# EAGLE design MainBoard 1.7.0 (EAGLE 9.6.2)
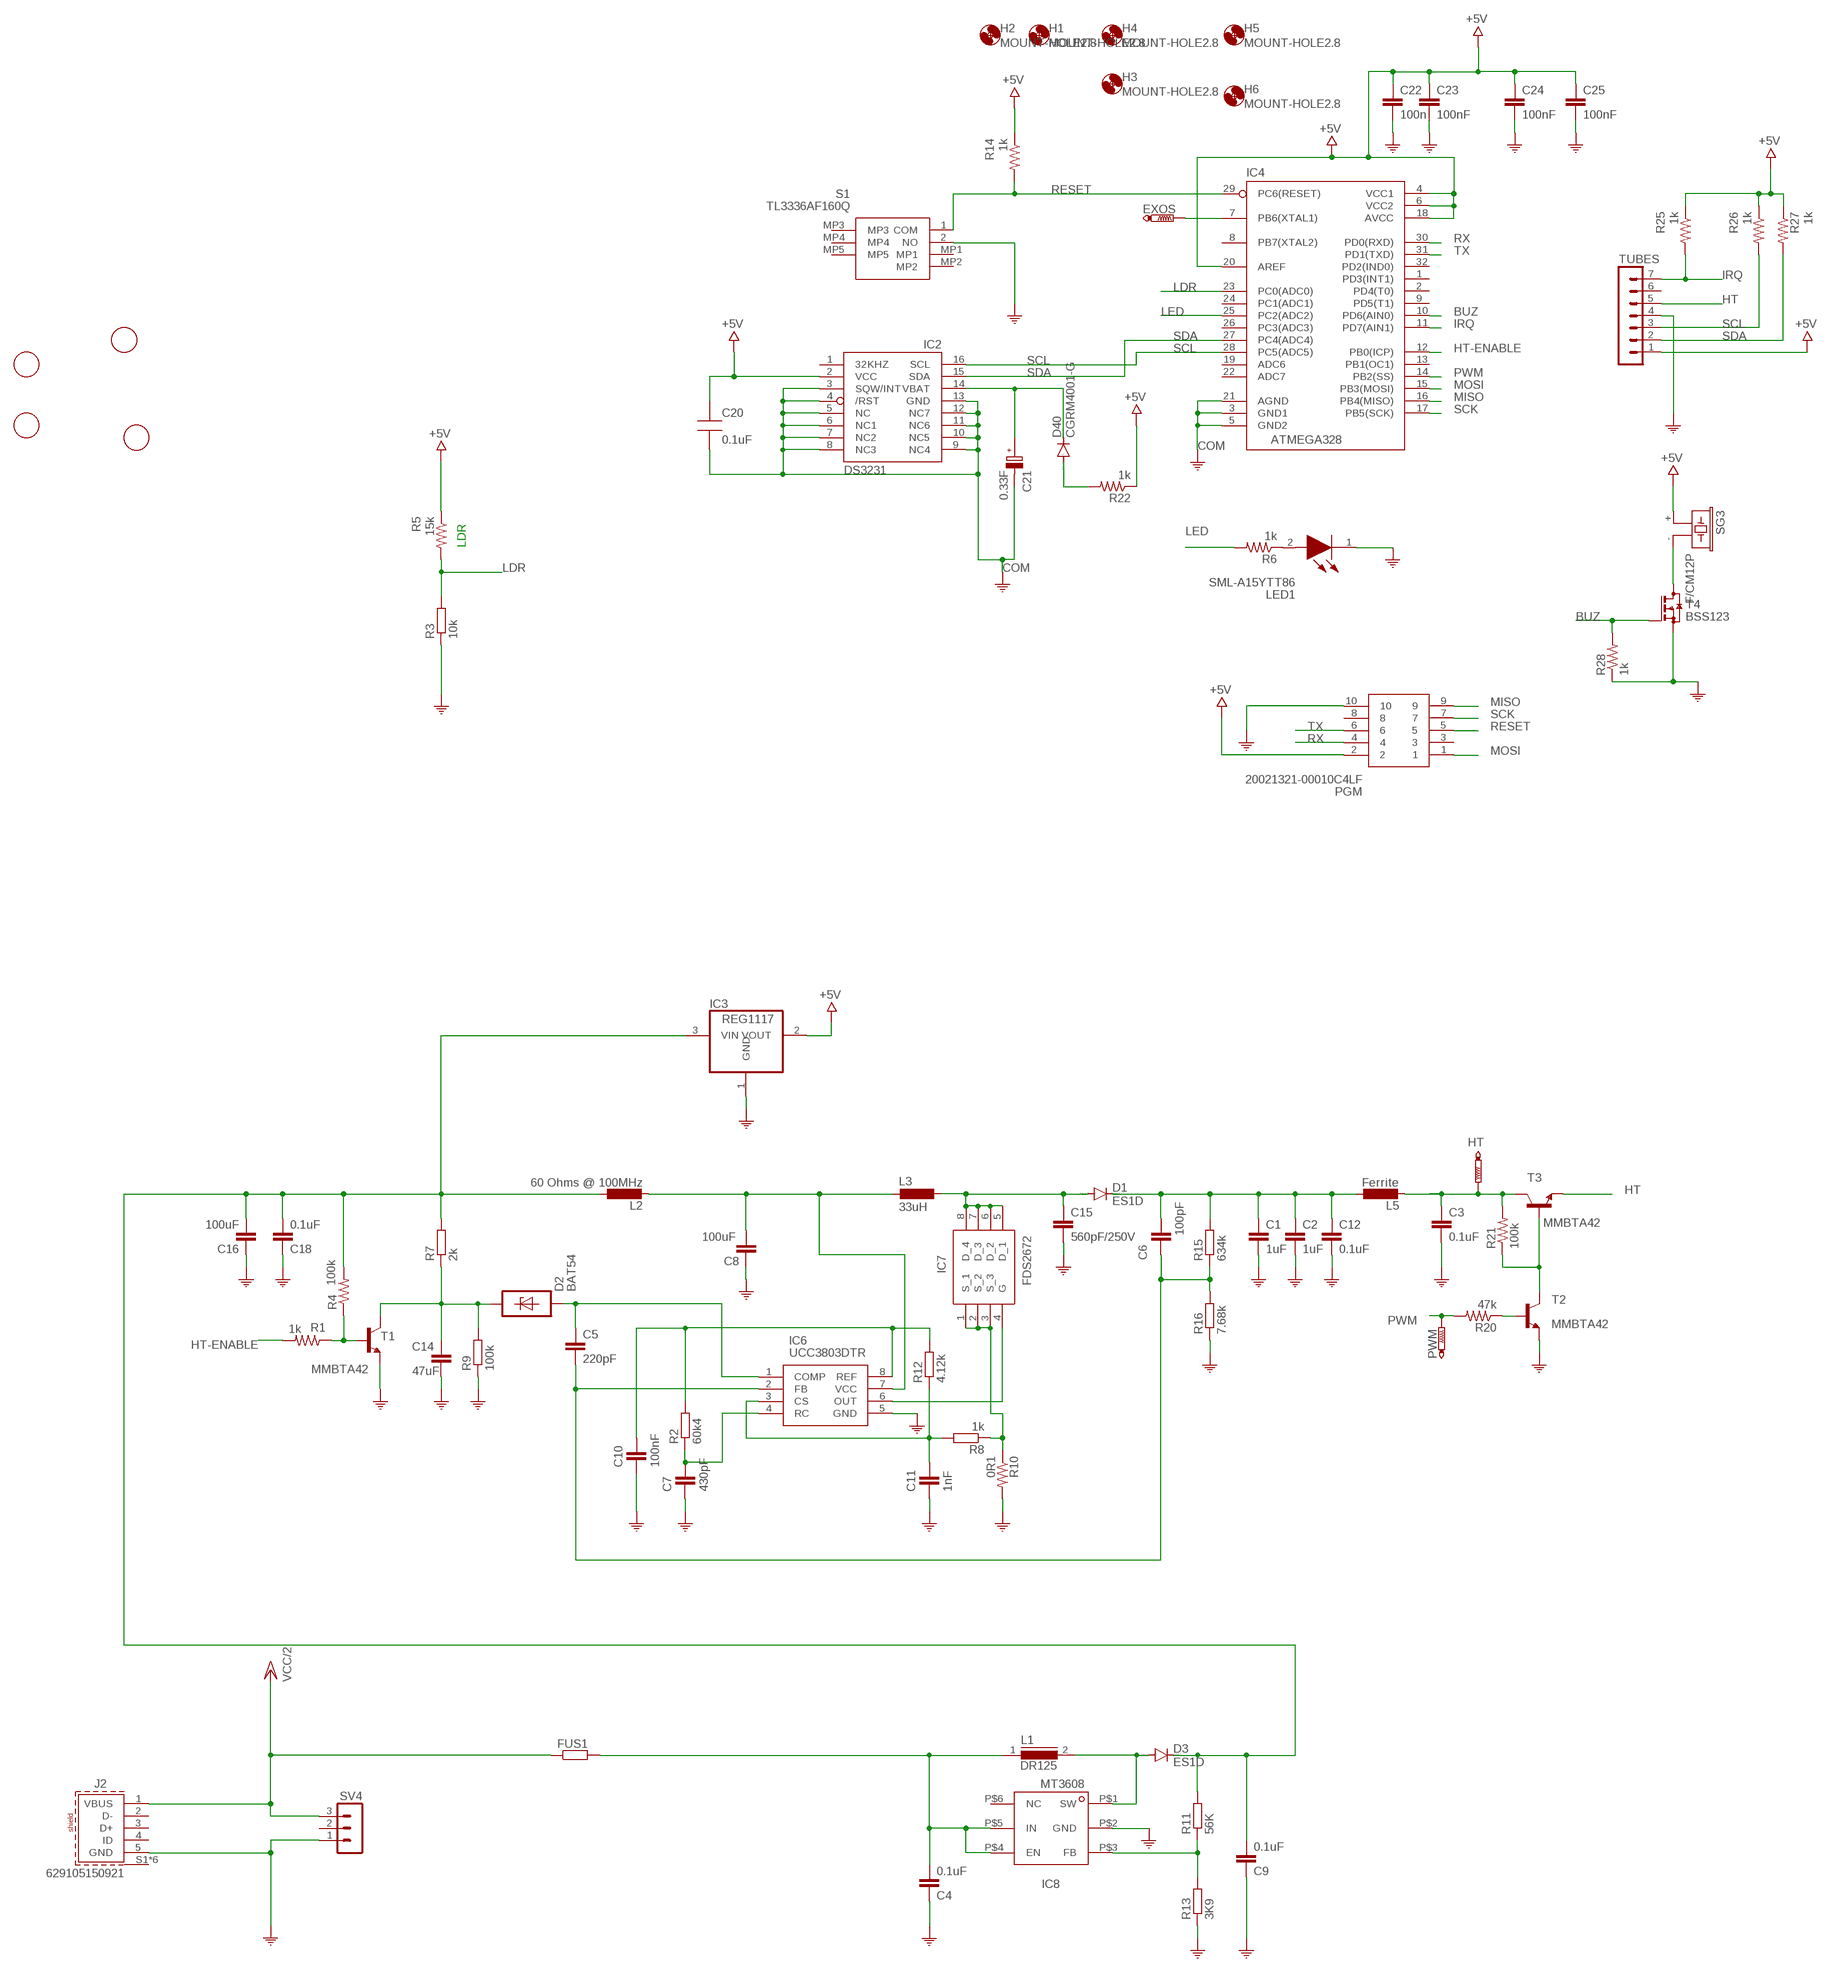
[diagram p0: schematic, sheet 1]

## Parts
C1  1uF  C-EUC1812K  [C1812K]
C2  1uF  C-EUC1812K  [C1812K]
C3  0.1uF  C-EUC1808  [C1808]
C4  0.1uF  C-EUC1206  [C1206]
C5  220pF  C-EUC0402  [C0402]
C6  100pF  C-EUC0805  [C0805]
C7  430pF  C-EUC0805  [C0805]
C8  100uF  C-EUC1210  [C1210]
C9  0.1uF  C-EUC1206K  [C1206K]
C10  100nF  C-EUC0805  [C0805]
C11  1nF  C-EUC0805  [C0805]
C12  0.1uF  C-EUC1808  [C1808]
C14  47uF  C-EUC1210  [C1210]
C15  560pF/250V  C-EUC0603  [C0603]
C16  100uF  C-EUC1210  [C1210]
C18  0.1uF  C-EUC0402  [C0402]
C20  0.1uF  CAP0805-NP  [CAP0805-NP]
C21  0.33F  AHG-35/100-RADIAL  [ELNA21.5X8.0]
C22  100n  C-EUC0805  [C0805]
C23  100nF  C-EUC0805  [C0805]
C24  100nF  C-EUC0805  [C0805]
C25  100nF  C-EUC0805  [C0805]
D1  ES1D  ES2D  [SMB]
D2  BAT54  SP4020-01FTG  [SOD323]
D3  ES1D  ES2D  [SMB]
D40  CGRM4001-G  [SOD-123_MINI-SMA]
EXOS  PTR1TP09R  [TP09R]
FUS1  R-EU_R6332  [R6332]
H1  MOUNT-HOLE2.8  [2,8]
H2  MOUNT-HOLE2.8  [2,8]
H3  MOUNT-HOLE2.8  [2,8]
H4  MOUNT-HOLE2.8  [2,8]
H5  MOUNT-HOLE2.8  [2,8]
H6  MOUNT-HOLE2.8  [2,8]
HT  PTR1TP09R  [TP09R]
IC2  DS3231/SO  [SO16W]
IC3  REG1117  [SOT223]
IC4  ATMEGA328  ATMEGA168-20AU  [QFP032]
IC6  UCC3803DTR  [SOIC127P600X175-8N]
IC7  FDS2672  [SOIC127P600X175-8N]
IC8  MT3608SOT23-6  [SOT23-6]
J2  629105150921  [629105150921]
L1  DR125  [DR125]
L2  60 Ohms @ 100MHz  L-EUL2012C  [L2012C]
L3  33uH  MSS7341  [MSS7341]
L5  Ferrite  L-EUL2012C  [L2012C]
LED1  SML-A15YTT86  [SMLA15YTT86]
PGM  20021321-00010C4LF  [2002132100010C4LF]
PWM  PTR1TP09R  [TP09R]
R1  1k  R-US_R0805  [R0805]
R2  60k4  R-EU_R0805  [R0805]
R3  10k  R-EU_0204/2V  [0204V]
R4  100k  R-US_R0805  [R0805]
R5  15k  R-US_M2012  [M2012]
R6  1k  R-US_M2012  [M2012]
R7  2k  R-EU_R0805  [R0805]
R8  1k  R-EU_R0805  [R0805]
R9  100k  R-EU_R0805  [R0805]
R10  0R1  R-US_R2010  [R2010]
R11  56K  R-EU_R0805  [R0805]
R12  4.12k  R-EU_R0805  [R0805]
R13  3K9  R-EU_R0805  [R0805]
R14  1k  R-US_M2012  [M2012]
R15  634k  R-EU_R0805  [R0805]
R16  7.68k  R-EU_R0805  [R0805]
R20  47k  R-US_R0805  [R0805]
R21  100k  R-US_R0805  [R0805]
R22  1k  R-US_M2012  [M2012]
R25  1k  R-US_M2012  [M2012]
R26  1k  R-US_M2012  [M2012]
R27  1k  R-US_M2012  [M2012]
R28  1k  R-US_M2012  [M2012]
S1  TL3336AF160Q  [TL3336AF160Q]
SG3  F/CM12P  [F/CM12P]
SV4  MA03-1  [MA03-1]
T1  MMBTA42  BC846  [SOT23]
T2  MMBTA42  BC846  [SOT23]
T3  MMBTA42  BC846  [SOT23]
T4  BSS123  [SOT23]
TUBES  MA07-1  [MA07-1]
U$4  FIDUCIAL  [FIDUCIAL_1MM]
U$5  FIDUCIAL  [FIDUCIAL_1MM]
U$20  FIDUCIAL  [FIDUCIAL_1MM]
U$36  FIDUCIAL  [FIDUCIAL_1MM]

## Nets
+5V [pwr]: C20.1 C22.1 C23.1 C24.1 C25.1 IC2.2(VCC) IC3.2(VOUT) IC4.4(VCC1) IC4.6(VCC2) IC4.18(AVCC) IC4.20(AREF) PGM.2 R5.1 R14.1 R22.1 R25.1 R26.1 R27.1 SG3.+ TUBES.1
BATT: C21.+ D40.C IC2.14(VBAT)
BUZ: IC4.10(PD6(AIN0)) R28.2 T4.1(G)
COM: C1.2 C2.2 C3.2 C4.2 C7.2 C8.1 C9.2 C10.2 C11.2 C12.2 C14.2 C15.2 C16.1 C18.2 C20.2 C21.- C22.2 C23.2 C24.2 C25.2 IC2.3(SQW/INT) IC2.4(/RST) IC2.5(NC) IC2.6(NC1) IC2.7(NC2) IC2.8(NC3) IC2.9(NC4) IC2.10(NC5) IC2.11(NC6) IC2.12(NC7) IC2.13(GND) IC3.1(GND) IC4.3(GND1) IC4.5(GND2) IC4.21(AGND) IC6.5(GND) IC8.P$2(GND) J2.5(GND) LED1.1(K) PGM.10 R3.1 R9.1 R10.2 R13.1 R16.1 R28.1 S1.2(NO) SV4.1 T1.2(E) T2.2(E) T4.2(S) TUBES.4
CS: C11.1 IC6.3(CS) R8.2 R12.1
FB: C5.2 C6.2 IC6.2(FB) R15.1 R16.2
HT: T3.2(E) TUBES.5
HT-ENABLE: IC4.12(PB0(ICP)) R1.2
IRQ: IC4.11(PD7(AIN1)) R25.2 TUBES.7
LDR: IC4.23(PC0(ADC0)) R3.2 R5.2
LED: IC4.25(PC2(ADC2)) R6.2
MISO: IC4.16(PB4(MISO)) PGM.9
MOSI: IC4.15(PB3(MOSI)) PGM.1
N$1: LED1.2(A) R6.1
N$2: C4.1 FUS1.2 IC8.P$4(EN) IC8.P$5(IN) L1.1
N$3: SG3.- T4.3(D)
N$5: EXOS.TP IC4.7(PB6(XTAL1))
N$6: C1.1 C2.1 C6.1 C12.1 D1.C L5.1 R15.2
N$7: R21.1 T2.3(C) T3.1(B)
N$8: R1.1 R4.1 T1.1(B)
N$9: C14.1 D2.C R7.1 R9.2 T1.3(C)
N$10: C5.1 D2.A IC6.1(COMP)
N$11: IC8.P$3(FB) R11.1 R13.2
N$12: IC7.1(S_1) IC7.2(S_2) IC7.3(S_3) R8.1 R10.1
N$13 [pwr]: D3.A IC8.P$1(SW) L1.2
N$14: C8.2 IC6.7(VCC) L2.2 L3.1
N$18: C15.1 D1.A IC7.5(D_1) IC7.6(D_2) IC7.7(D_3) IC7.8(D_4) L3.2
N$19: R20.1 T2.1(B)
N$23: D40.A R22.2
OUT: IC6.6(OUT) IC7.4(G)
POSTFUSE [pwr]: C9.1 C16.2 C18.1 D3.C IC3.3(VIN) L2.1 R4.2 R7.2 R11.2
PWM: IC4.14(PB2(SS)) PWM.TP R20.2
RAW_HT: C3.1 HT.TP L5.2 R21.2 T3.3(C)
RC: C7.1 IC6.4(RC) R2.1
REF: C10.1 IC6.8(REF) R2.2 R12.2
RESET: IC4.29(PC6(RESET)) PGM.5 R14.2 S1.1(COM)
RX: IC4.30(PD0(RXD)) PGM.4
SCK: IC4.17(PB5(SCK)) PGM.7
SCL: IC2.16(SCL) IC4.28(PC5(ADC5)) R26.2 TUBES.3
SDA: IC2.15(SDA) IC4.27(PC4(ADC4)) R27.2 TUBES.2
TX: IC4.31(PD1(TXD)) PGM.6
VCC/2: FUS1.1 J2.1(VBUS) SV4.3
Unconnected: IC2.1(32KHZ) IC4.1(PD3(INT1)) IC4.2(PD4(T0)) IC4.8(PB7(XTAL2)) IC4.9(PD5(T1)) IC4.13(PB1(OC1)) IC4.19(ADC6) IC4.22(ADC7) IC4.24(PC1(ADC1)) IC4.26(PC3(ADC3)) IC4.32(PD2(IND0)) IC8.P$6(NC) J2.2(D-) J2.3(D+) J2.4(ID) J2.S1(SHIELD) J2.S2(SHIELD) J2.S3(SHIELD) J2.S4(SHIELD) J2.S5(SHIELD) J2.S6(SHIELD) PGM.3 PGM.8 S1.MP1 S1.MP2 S1.MP3 S1.MP4 S1.MP5 SV4.2 TUBES.6

## Notes on the sheet
- LDR

## Library data of the parts
C1 C2 = rcl:C-EU: CAPACITOR, European symbol; MOUSER: 810-CGA8P3X7T2E105MA; PU: 1.07; SPICEPREFIX: C; TDK: C4532X7T2E105M250KE
C3 C12 = rcl:C-EU: CAPACITOR, European symbol; MOUSER: 581-1808PC104KAT1A; PU: 0.88; SPICEPREFIX: C
C4 C9 C18 = rcl:C-EU: CAPACITOR, European symbol; MOUSER: 963-LMF105B7104KVHF; PU: 0.676; SPICEPREFIX: C
C5 = rcl:C-EU: CAPACITOR, European symbol; MOUSER: 963-LMK042B7221KC-W; SPICEPREFIX: C
C6 = rcl:C-EU: CAPACITOR, European symbol; MOUSER: 81-GCM21A5C2E101JX1D; PU: 0.319; SPICEPREFIX: C
C7 = rcl:C-EU: CAPACITOR, European symbol; MOUSER: 581-08055A431JAT4A; PU: 0.23; SPICEPREFIX: C
C8 C16 = rcl:C-EU: CAPACITOR, European symbol; MOUSER: 963-EMK325ABJ107MM-P; SPICEPREFIX: C; TAIYO_YUDEN: EMK325ABJ107MM-P
C10 = rcl:C-EU: CAPACITOR, European symbol; MOUSER: 963-EMF212B7104KGHT; PU: 0.23; SPICEPREFIX: C
C11 = rcl:C-EU: CAPACITOR, European symbol; MOUSER: 710-885382207004; PU: 0.122; SPICEPREFIX: C
C14 = rcl:C-EU: CAPACITOR, European symbol; MOUSER: 963-EMK325BJ476MM-P; SPICEPREFIX: C
C15 = rcl:C-EU: CAPACITOR, European symbol; MOUSER: 80-C0603C561JAG; PU: 0.038; SPICEPREFIX: C
C20 = MySMD:CAP0805-NP
C21 = Elkos:AHG-35/100-RADIAL: AUDYN® - AHG Gepolt, radial High Grade AHG Gepolter Elekrolytkondensator für Audio-Netzteile, oder Verstärker im Home- und Car-Bereich. Technische Daten Anschlußdrähte: Kupfer, verzinnt AL: ? mm d2ø : ? mm Kapazitätsbereich: von 10 µF bis 2200 µF Nennspannungen: 25 V, 35 V, 50 V, 100 V C-Toleranz: 20 % ( bei 20° C ) Verlustfaktor: tan δ < 0,100 @ 1 kHz Temperaturbereich: - 40° C bis 85° C Verzerrung: sehr gering bei 10 kHz, 010 A - 120 dB oder niedriger gepolt AHG AUDYN® - AHG gepolt Bezeichnung C U DxH Rm Bestell.-Nr. U / Volt D x L/mm mm AHG/10.0/100V 10µF 100V 10x15 5,0 1341690 AHG/22.0/50V 22µF 50V 10x13 5,0 1341691 AHG/47.0/50V 47µF 50V 10x16 5,0 1341692 AHG/100.0/50V 100µF 50V 13x21 5,0 1341693 AHG/220.0/50V 220µF 50V 16x25 7,5 1341694 AHG/470.0/50V 470µF 50V 16x37 7,5 1341695 AHG/1000/35V 1000µF 35V 18x37 7,5 1341696 AHG/2200/35V 2200µF 35V 22x38 10,0 1341697 Alle Abmessungen in mm; MOUSER: 555-DBN-5R5D334T; PU: 2.46
C22-C25 = rcl:C-EU: CAPACITOR, European symbol; SPICEPREFIX: C
D1 D3 = diode:ES2D: DIODE super fast rectifier, 2 A; MOUSER: 512-ES1DF
D2 = sp4020_11:SP4020-01FTG: SP4020 Series 2.5pF, 30A Discrete TVS Diode Source: http://www.littelfuse.com/~/media/electronics/datasheets/tvs_diode_arrays/littelfuse_tvs_diode_array_sp4020_datasheet.pdf.pdf; MF: Littelfuse; MOUSER: 621-BAT54WS-F; MPN: SP4020-01FTG; OC_FARNELL: unknown; OC_NEWARK: 05X0400
D40 = diode:CGRM400*-G: Molded plasitc,JEDEC SOD-123/Mini SMA Source: Comchip CGRM4001-G.pdf; MOUSER: 863-NSR0320MW2T1G; PU: 0.22
EXOS HT PWM = testpad:PTR1: TEST PIN
FUS1 = rcl:R-EU_: RESISTOR, European symbol; MOUSER: 530-0ZCG0150AF2C; PU: 0.2; SPICEPREFIX: R
H1-H6 = holes:MOUNT-HOLE: MOUNTING HOLE with drill center marker
IC2 = DS3231:DS3231; AVAILABILITY: Unavailable; MF: Maxim Integrated; MOUSER: 700-DS3231SN#; MP: DS3231; PACKAGE: SOIC-16 Maxim Integrated; PRICE: None; PU: 9.50
IC3 = burr-brown:REG1117: 800mA and 1A Low Dropout (LDO) Positive Regulator 1.8V, 2.5V, 2.85V, 3.3V, 5V, and Adj; MPN: REG1117; OC_FARNELL: 1097566; OC_NEWARK: 14P6981
IC4 = MySMD:ATMEGA168-20AU; PU: 1.40
IC6 = UCC3803DTR:UCC3803DTR: Switching Controllers Low-Power BiCMOS Current-Mode PWM Source: Datasheet <http://www.ti.com/lit/ds/symlink/ucc3803.pdf>; DESCRIPTION: Switching Controllers Low-Power BiCMOS Current-Mode PWM; HEIGHT: 1.75mm; MANUFACTURER_NAME: Texas Instruments; MANUFACTURER_PART_NUMBER: UCC3803DTR; MOUSER: 595-UCC3803D; MOUSER_PART_NUMBER: 595-UCC3803DTR; MOUSER_PRICE-STOCK: https://www.mouser.com/Search/Refine.aspx?Keyword=595-UCC3803DTR; PU: 3.05
IC7 = FDS2672:FDS2672: FDS2672, N-channel MOSFET Transistor 3.9 A 200 V, 8-Pin SOIC Source: Datasheet <http://docs-emea.rs-online.com/webdocs/0d23/0900766b80d23481.pdf>; DESCRIPTION: FDS2672, N-channel MOSFET Transistor 3.9 A 200 V, 8-Pin SOIC; HEIGHT: 1.75mm; MANUFACTURER_NAME: Fairchild Semiconductor; MANUFACTURER_PART_NUMBER: FDS2672; MOUSER: 512-FDS2672; MOUSER_PART_NUMBER: 512-FDS2672; MOUSER_PRICE-STOCK: https://www.mouser.com/Search/Refine.aspx?Keyword=512-FDS2672; PU: 1.54; RS_PART_NUMBER: 6710481P; RS_PRICE-STOCK: http://uk.rs-online.com/web/p/products/6710481P
IC8 = MT3608:MT3608: MT3608 High Efficiency 1.2MHz 2A Step Up Converter BY: Rangana Tennakoon
J2 = Wurth_Connectors_WR-USB:629105150921: WR-COM Micro USB 2.0 Type AB Horizontal Kind Properties Durability:10 000 Mating cycles Connector Type:Micro USB Gender:Receptacle Type:Horizontal General Information Operating Temperature:-40up to +85 °C Electrical Properties Working Voltage:30V (AC) Withstanding Voltage:100V (AC) Contact Resistance:30 mΩ Material Properties Insulator Material:LCP Insulator Flammability Rating:UL94 V-0 Color:Black Contact Material:Copper Alloy Contact Plating: Gold Contact Type:Stamped Shielding Material:Stainless Steel Shielding Plating:Matte Tin <https://www.we-online.com/catalog/media/o33046v209%20Family_WR-COM_Micro_USB_629105150921.jpg> Details see: https://www.we-online.com/catalog/en/COM_MICRO_2_0_TYPE_AB_HORIZONTAL/ Updated by Ella Wu 2021-03-09 2021 (C) Würth Elektronik; APPLICATION: Micro USB 2.0; DATASHEET-URL: https://www.we-online.com/catalog/datasheet/629105150921.pdf; GERDER: Receptacle; INTERFACE-TYPE: Type AB; IR1: 1.8A; MOUNT: SMT; MOUSER: 710-629105150921; PACKAGING: Tape and Reel; PART-NUMBER: 629105150921; PINS: 5; PU: 1.90; TYPE: Horizontal; WORKING-VOLTAGE: 30V(AC)
L1 = inductors:DR125: High Power Density, High Efficiency, Shielded Inductors Source: coiltronics_dr_series.pdf; SPICEPREFIX: L
L2 L5 = rcl:L-EU: INDUCTOR, European symbol; MOUSER: 963-BKP2125HS600-T; SPICEPREFIX: L
L3 = STEAM-inductor-coilcraft:MSS7341: Shielded Power Inductors Package 6.6 × 6.6 mm x 4.1 mm high Source: http://www.farnell.com/datasheets/1681958.pdf; MOUSER: 710-784770330; PU: 2.55
LED1 = SamacSys_Parts:SML-A15YTT86: Yellow 590nm LED Indication - Discrete 2.1V 2-SMD, No Lead Source: Datasheet <https://fscdn.rohm.com/en/products/databook/datasheet/opto/led/chip_mono/sml-a15x-e.pdf>; DESCRIPTION: Yellow 590nm LED Indication - Discrete 2.1V 2-SMD, No Lead; HEIGHT: 0.65mm; MANUFACTURER_NAME: ROHM Semiconductor; MANUFACTURER_PART_NUMBER: SML-A15YTT86; MOUSER: 755-SML-A15YTT86; PU: 0.25
PGM = SamacSys_Parts:20021321-00010C4LF: Headers & Wire Housings 1.27x1.27mm BTB, Hdr Recept, SMT, 10 Pos Source: Datasheet <https://componentsearchengine.com/Datasheets/1/20021321-00010C4LF.pdf>; DESCRIPTION: Headers & Wire Housings 1.27x1.27mm BTB, Hdr Recept, SMT, 10 Pos; HEIGHT: 4.75mm; MANUFACTURER_NAME: Amphenol; MANUFACTURER_PART_NUMBER: 20021321-00010C4LF; MOUSER_PART_NUMBER: 649-202132100010C4LF; MOUSER_PRICE-STOCK: https://www.mouser.com/Search/Refine.aspx?Keyword=649-202132100010C4LF
R1 R4-R6 R14 R20-R22 R25-R28 = adafruit:R-US_: RESISTOR, American symbol
R2 = rcl:R-EU_: RESISTOR, European symbol; MOUSER: 603-RT0805FRE0760K4L; PU: 0.11; SPICEPREFIX: R
R3 R8 R9 = rcl:R-EU_: RESISTOR, European symbol; SPICEPREFIX: R
R7 = rcl:R-EU_: RESISTOR, European symbol; MOUSER: 754-RR1220P-202D; SPICEPREFIX: R; SUSUMU: RR1220P-202-D
R10 = adafruit:R-US_: RESISTOR, American symbol; MOUSER: 603-PE2010FKE070R1L; PU: 0.7
R11 R13 R15 = rcl:R-EU_: RESISTOR, European symbol; MOUSER: 71-CRCW0603-634K-E3; SPICEPREFIX: R; VISHAY: CRCW0603634KFKEA
R12 = rcl:R-EU_: RESISTOR, European symbol; KOASPEER: RN732ATTD4121F100; MOUSER: 660-RN732ATD4121F100; SPICEPREFIX: R
R16 = rcl:R-EU_: RESISTOR, European symbol; MOUSER: 71-CRCW0805-7.68K-E3; PU: 0.09; SPICEPREFIX: R; VISHAY: CRCW08057K68FKEA
S1 = SamacSys_Parts:TL3336AF160Q: Tactile Switches Tactile Switch SPST OFF-(ON) 50mA, 12VDC, Right Angle SMT Source: Datasheet <http://spec_sheets.e-switch.com/specs/P158001.pdf>; DESCRIPTION: Tactile Switches Tactile Switch SPST OFF-(ON) 50mA, 12VDC, Right Angle SMT; HEIGHT: 7.35mm; MANUFACTURER_NAME: E-Switch; MANUFACTURER_PART_NUMBER: TL3336AF160Q; MOUSER_PART_NUMBER: 612-TL3336AF160Q; MOUSER_PRICE-STOCK: https://www.mouser.co.uk/ProductDetail/E-Switch/TL3336AF160Q?qs=iLbezkQI%252Bshf0NMs3%252BGhxA%3D%3D
SG3 = buzzer:F/CM12P: BUZZER Source: Buerklin; OC_FARNELL: unknown; OC_NEWARK: unknown
SV4 = con-lstb:MA03-1: PIN HEADER; OC_FARNELL: unknown; OC_NEWARK: unknown
T1-T3 = transistor:BC846: NPN TRANSISTOR
T4 = transistor-small-signal:BSS123: N-CHANNEL MOS FET; MOUSER: 726-BSS123NH6433; PU: 0.37
TUBES = con-lstb:MA07-1: PIN HEADER; OC_FARNELL: unknown; OC_NEWARK: unknown
U$4 U$5 U$20 U$36 = adafruit:FIDUCIAL: For use by pick and place machines to calibrate the vision/machine, 1mm By microbuilder.eu

## Module TUBEIN16
Ports: 

### Library data of the parts

## Net classes
0 default: width 0.254 mm, clearance 0.254 mm
1 pwr: width 0.254 mm, clearance 0.356 mm

## Board
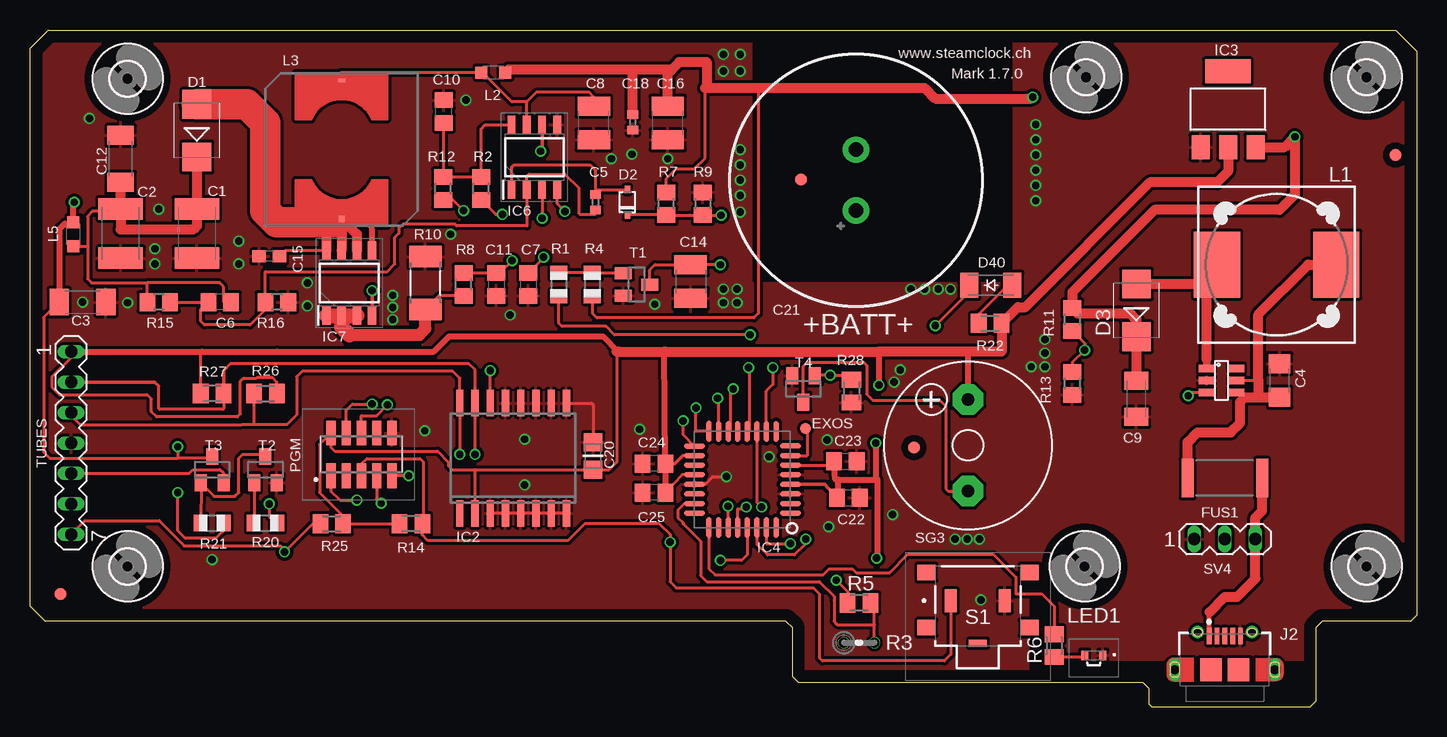
[diagram p1: board, top side]
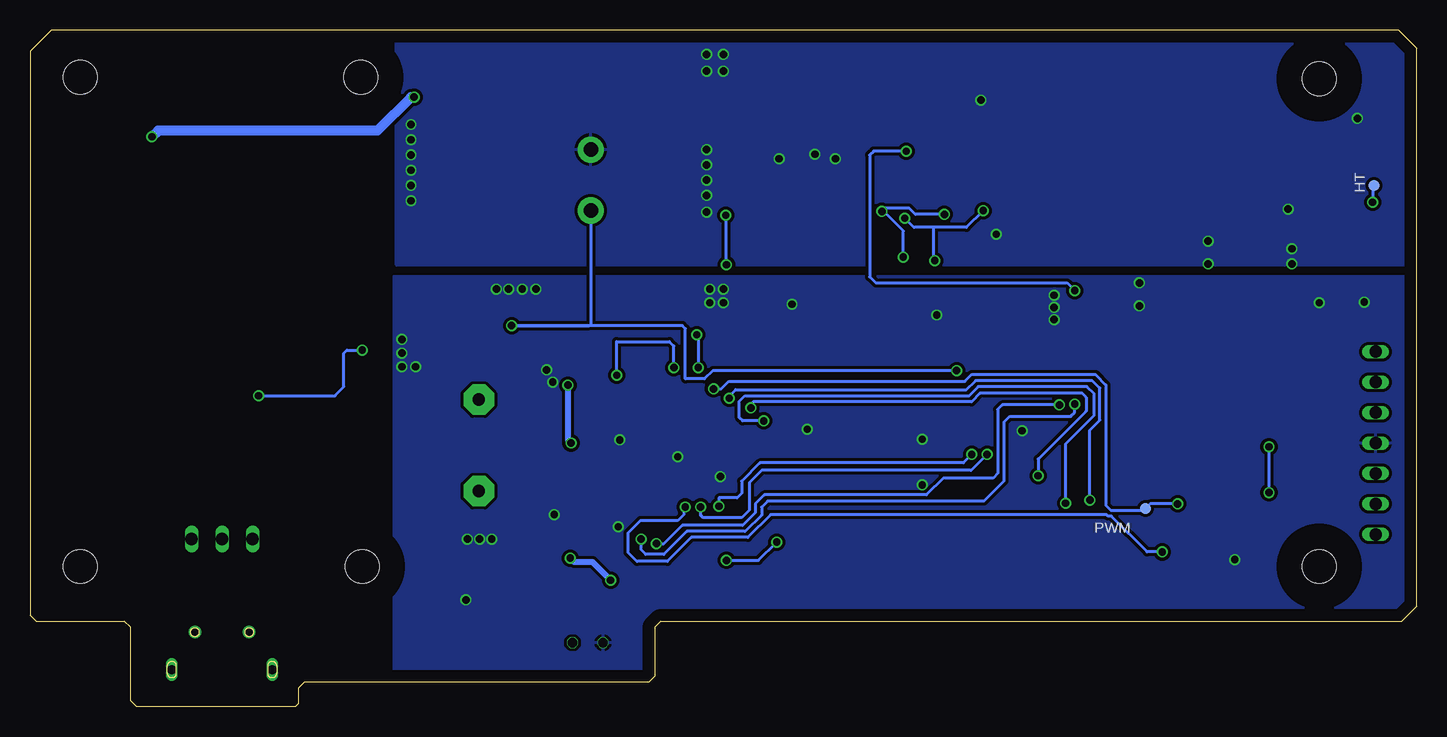
[diagram p2: board, bottom side, seen from below]

Size 115.57 x 56.39 mm. Coordinates in mm from the lower left corner, seen from the top.
Outline: 1.52,56.39 113.79,56.39 115.57,54.61 115.57,7.62 115.06,7.11 107.7,7.11 107.19,6.6 107.19,0.51 106.68,0 93.47,0 93.22,0.25 93.22,1.52 92.71,2.03 64.01,2.03 63.5,2.54 63.5,6.6 62.99,7.11 1.27,7.11 0,8.38 0,54.86 1.52,56.39
Copper layers (1*16): Top 0.035mm / dielectric 1.5mm / Bottom 0.035mm
Design rules "default *": minimum track width 10mil, minimum drill 24mil, track to track 4mil, track to pad 1mil, pad to pad 1mil, via to via 8mil, smd to smd 8mil, copper to edge 40mil, drill to drill 8mil, minimum pad ring 1mil, minimum via ring 3mil, stop-mask expansion 4mil, vias tented up to drill 0mil, thermal gap 10mil

### Footprints (pad centres in the part's own frame; a part is rotated, then mirrored left to right if it is on the bottom)
C1812K = smd 1.8 x 3.7: 1 -2.05,0; 2 2.05,0
C1808 = smd 1.6 x 2.2: 1 -1.95,0; 2 1.95,0
C1206 = smd 1.6 x 1.8: 1 -1.4,0; 2 1.4,0
C0402 = smd 0.7 x 0.9: 1 -0.65,0; 2 0.65,0
C0805 = smd 1.3 x 1.5: 1 -0.95,0; 2 0.95,0
C1210 = smd 1.6 x 2.7: 1 -1.4,0; 2 1.4,0
C1206K = smd 1.5 x 2: 1 -1.5,0; 2 1.5,0
C0603 = smd 1.1 x 1: 1 -0.85,0; 2 0.85,0
CAP0805-NP = smd 1.524 x 1.524: 1 0,0; 2 2.286,0
ELNA21.5X8.0 = drill 1.2 pad 2.184: + -2.54,0; - 2.54,0
SMB = smd 2.4 x 2.4: A 2.2,0; C -2.2,0
SOD323 = smd 0.6 x 0.45: A 1.06,0; C -1.06,0
SOD-123_MINI-SMA = smd 1.5 x 2.1: A 1.8,0; C -1.8,0
TP09R = smd 0.9 x 0.9: TP 0,0
R6332 = smd 1 x 3.2: 1 -3.1,0; 2 3.1,0
2,8 = hole 2.8: 0,0
SO16W = smd 0.6 x 2.2: 1 -4.445,-4.6; 2 -3.175,-4.6; 3 -1.905,-4.6; 4 -0.635,-4.6; 5 0.635,-4.6; 6 1.905,-4.6; 7 3.175,-4.6; 8 4.445,-4.6; 9 4.445,4.6; 10 3.175,4.6; 11 1.905,4.6; 12 0.635,4.6; 13 -0.635,4.6; 14 -1.905,4.6; 15 -3.175,4.6; 16 -4.445,4.6
SOT223 = smd 1.499 x 2.007: 1 -2.261,-3.15; 2 0.025,-3.15; 3 2.311,-3.15 | smd 3.81 x 2.007: 4 0,3.15
QFP032 = smd 0.432 x 1.778: 1 0,0; 2 0.8,0; 3 1.599,0; 4 2.399,0; 5 3.199,0; 6 3.998,0; 7 4.798,0; 8 5.598,0; 17 5.588,8.001; 18 4.798,7.997; 19 3.998,7.997; 20 3.199,7.997; 21 2.399,7.997; 22 1.599,7.997; 23 0.799,7.997; 24 0,7.997 | smd 1.778 x 0.432: 9 6.807,1.194; 10 6.807,2.007; 11 6.807,2.794; 12 6.807,3.607; 13 6.807,4.394; 14 6.807,5.182; 15 6.807,5.994; 16 6.816,6.803; 25 -1.194,6.807; 26 -1.194,5.994; 27 -1.194,5.182; 28 -1.194,4.394; 29 -1.194,3.607; 30 -1.194,2.794; 31 -1.194,2.007; 32 -1.194,1.194
SOIC127P600X175-8N = smd 1.525 x 0.65: 1 -2.712,1.905; 2 -2.712,0.635; 3 -2.712,-0.635; 4 -2.712,-1.905; 5 2.712,-1.905; 6 2.712,-0.635; 7 2.712,0.635; 8 2.712,1.905
SOIC127P600X175-8N' = smd 1.525 x 0.7: 1 -2.712,1.905; 2 -2.712,0.635; 3 -2.712,-0.635; 4 -2.712,-1.905; 5 2.712,-1.905; 6 2.712,-0.635; 7 2.712,0.635; 8 2.712,1.905
SOT23-6 = smd 1.27 x 0.635: P$1 0,0; P$2 0,-1; P$3 0,-2; P$4 2.5,-2; P$5 2.5,-1; P$6 2.5,0
629105150921 = smd 0.4 x 1.35: 1 -1.3,2.335; 2 -0.65,2.335; 3 0,2.335; 4 0.65,2.335; 5 1.3,2.335 | drill 0.65 pad 1.05: S1 -2.26,2.65; S2 2.26,2.65 | drill 0.75 pad 0.95 long: S3 -4.175,-0.47; S6 4.175,-0.47 | smd 1.8 x 1.9: S4 -1.15,-0.47; S5 1.15,-0.47
DR125 = smd 3.85 x 5.5: 1 -4.975,0; 2 4.975,0
L2012C = smd 1 x 1: 1 -1,0; 2 1,0
MSS7341 = smd 0.61 x 0.305: 1 0,5.765 | smd 0.5 x 0.5: 2 0,-5.765
SMLA15YTT86 = smd 0.6 x 0.8: 1 -0.75,-0.205; 2 0.75,-0.205
2002132100010C4LF = smd 0.76 x 2.05: 1 2.54,1.775; 2 2.54,-1.775; 3 1.27,1.775; 4 1.27,-1.775; 5 0,1.775; 6 0,-1.775; 7 -1.27,1.775; 8 -1.27,-1.775; 9 -2.54,1.775; 10 -2.54,-1.775
R0805 = smd 1.1 x 1.4: 1 -1,0; 2 1,0
R0805' = smd 1.3 x 1.5: 1 -0.95,0; 2 0.95,0
0204V = drill 0.813 octagon: 1 -1.27,0; 2 1.27,0
M2012 = smd 1.3 x 1.6: 1 -0.95,0; 2 0.95,0
R2010 = smd 1.8 x 2.7: 1 -2.2,0; 2 2.2,0
TL3336AF160Q = smd 1 x 1.9: 1 2.25,-0.45; 2 -2.25,-0.45 | smd 1.5 x 1.3: MP1 4.3,1.8; MP2 4.3,-2.8; MP3 -4.3,-2.8; MP4 -4.3,1.8 | smd 1.5 x 0.6: MP5 0,3.1
F/CM12P = drill 1.016 pad 2.54 octagon: + 3.81,0; - -3.81,0
MA03-1 = drill 1.016 long: 1 -2.54,0; 2 0,0; 3 2.54,0
SOT23 = smd 1 x 1.4: 1 -0.95,-1.1; 2 0.95,-1.1; 3 0,1.1
MA07-1 = drill 1.016 long: 1 -7.62,0; 2 -5.08,0; 3 -2.54,0; 4 0,0; 5 2.54,0; 6 5.08,0; 7 7.62,0
FIDUCIAL_1MM = smd 1 x 1: 1 0,0

### Placement (x,y rotation side)
C1  13.91,39.43 270 top
C2  7.56,39.43 270 top
C3  4.38,33.72 0 top
C4  104.14,27.18 90 top
C5  47.12,42.04 270 top
C6  15.81,33.72 180 top
C7  41.53,35.18 270 top
C8  46.99,48.64 90 top
C9  92.2,25.65 270 top
C10  34.48,49.59 90 top
C11  38.86,35.18 270 top
C12  7.56,45.66 90 top
C14  55.05,35.43 270 top
C15  19.94,37.53 180 top
C16  53.15,48.64 90 top
C18  50.23,48.7 270 top
C20  46.93,19.75 90 top
C21  68.83,43.88 90 top
C22  68.2,17.4 0 top
C23  67.95,20.45 0 top
C24  52.01,20.26 180 top
C25  52.01,17.84 180 top
D1  13.91,48.01 90 top
D2  49.78,42.04 90 top
D3  92.2,33.02 90 top
D40  80.07,35.12 0 top
EXOS  64.64,23.18 0 top
FUS1  99.57,19.05 180 top
H1  111.38,52.45 0 top
H2  111.38,11.68 0 top
H3  8.13,52.32 0 top
H4  8.13,11.68 0 top
H5  87.88,11.68 0 top
H6  88.01,52.45 0 top
HT  3.56,43.43 0 bottom
IC2  40.26,20.7 0 top
IC3  99.82,49.78 0 top
IC4  63.37,16.13 90 top
IC6  42.04,45.78 90 top
IC7  FDS2672  [SOIC127P600X175-8N']  26.61,35.31 90 top
IC8  98.04,28.19 0 top
J2  99.57,3.56 0 top
L1  103.89,36.83 180 top
L2  38.61,52.83 180 top
L3  25.97,46.42 0 top
L5  3.62,39.37 90 top
LED1  88.65,4.06 180 top
PGM  27.62,21.02 180 top
PWM  22.61,16.51 0 bottom
R1  44.07,35.18 270 top
R2  60k4  [R0805']  37.59,43.18 90 top
R3  69.09,5.33 0 top
R4  46.86,35.18 270 top
R5  69.09,8.64 0 top
R6  85.34,5.08 90 top
R7  2k  [R0805']  53.02,41.91 90 top
R8  1k  [R0805']  36.13,35.18 90 top
R9  100k  [R0805']  56.07,41.91 270 top
R10  32.96,35.31 90 top
R11  56K  [R0805']  86.87,32.26 90 top
R12  4.12k  [R0805']  34.42,43.18 90 top
R13  3K9  [R0805']  86.87,26.92 90 top
R14  31.75,15.24 0 top
R15  634k  [R0805']  10.73,33.72 180 top
R16  7.68k  [R0805']  20.57,33.72 180 top
R20  19.62,15.3 0 top
R21  15.18,15.3 0 top
R22  80.01,31.94 180 top
R25  25.15,15.24 180 top
R26  19.62,26.1 180 top
R27  15.18,26.1 0 top
R28  68.45,26.29 90 top
S1  78.99,8.38 180 top
SG3  78.17,21.78 90 top
SV4  99.57,13.97 0 top
T1  50.55,35.18 270 top
T2  19.62,19.75 0 top
T3  15.18,19.75 0 top
T4  64.45,26.48 180 top
TUBES  3.43,21.97 270 top
U$4  2.54,9.4 0 top
U$5  73.66,21.59 0 top
U$20  64.26,43.94 0 top
U$36  113.79,45.97 0 top

### Tracks (layer width: path | path; a pad name or v marks a point on that pad's centre or on a via)
+5V  (via drill 0.61)
  Top 0.254: 37.08,19.75 35.18,19.75 34.86,20.07 34.86,20.38 33.96,21.29 25.39,21.29 25.09,21.59 25.08,21.59 PGM.2 24.14,21.85 24.14,17.83 26.1,15.88 R25.1 R14.1 | 37.08,19.75 C20.1 48.26,19.75 48.89,20.38 48.89,29.59 | IC2.2 37.08,19.75 | IC4.20 54.34,19.33 C25.1 | 20.57,29.59 | R26.1 20.57,27.05 20.19,27.43 18.92,27.43 18.87,27.38 17.82,27.38 17.54,27.1 17.54,24.4 17.29,24.14 10.55,24.14 10.12,24.58 10.12,25.65 9.77,26.01 2.44,26.01 1.83,26.62 1.83,27.48 3.43,29.08 TUBES.1 | 14.35,29.59 14.23,29.47 R27.1 | IC4.18 54.42,20.93 | C24.1 52.86,29.49 52.96,29.59 | IC4.6 67.16,20.13 | v67.18,10.54 68.14,9.59 R5.1
  Top 0.305: IC4.4 66.25,18.53 C22.1 | 67.16,20.13 C23.1 | C24.1 53.75,20.26 54.42,20.93
  Top 0.508: C25.1 C24.1 52.86,29.59 | TUBES.1 14.35,29.59 20.57,29.59 33.66,29.59 34.92,30.86 47.75,30.86 49.02,29.59 | 67.37,18.92 C22.1 | 70.74,29.59 v70.74,26.8 | v70.48,21.97 70.48,18.92 | SG3.+ 78.17,29.53 78.23,29.59 | 67.37,18.92 67.12,18.92 C23.1 | 67.37,18.92 70.48,18.92 | 70.48,18.92 70.61,18.92 70.61,12.45 v70.55,12.38
  Top 0.813: 48.89,29.59 49.02,29.59 52.86,29.59 | 52.96,29.59 70.74,29.59 78.23,29.59 80.96,29.59 R22.1 82.32,33.3 82.94,33.3 93.32,43.69 98.93,43.69 99.85,44.6 IC3.2
  Bottom 0.508: v70.55,12.38 70.23,12.06 68.71,12.06 v67.18,10.54 | v70.74,26.8 70.74,22.23 v70.48,21.97
BATT  (via drill 0.61)
  Top 0.254: IC2.14 v38.35,28 | D40.C 78.27,34.59 v75.44,31.75
  Bottom 0.254: v38.35,28 58.67,28 59.37,27.3 60.96,27.3 60.96,31.5 61.21,31.75 v75.44,31.75 68.96,31.75 68.83,31.88 C21.+
BUZ  (via drill 0.61)
  Top 0.254: IC4.10 61.37,26.31 61.91,26.86 v61.91,28.26 | v66.67,27.62 66.74,27.62 | v66.67,27.62 68.45,27.62 R28.2 | v66.67,27.62 65.45,27.62 T4.1
  Bottom 0.254: v66.67,27.62 66.67,30.42 62.29,30.42 61.91,30.04 v61.91,28.26
COM  (via drill 0.61)
  Top 0.254: IC2.8 IC2.7 IC2.6 IC2.5 IC2.4 IC2.3 | IC2.9 46.77,25.3 46.93,25.15 C20.2 | IC4.21 55.48,18.63 56.34,18.63 56.89,19.18 v58.04,19.18
  other vias: 15.18,12.26 4.95,49.02 17.4,36.89 10.41,36.89 4.38,33.72 10.73,41.47 10.41,38.16 17.4,38.8 23.11,35.31 23.11,33.4 30.23,33.27 30.23,32.26 57.78,52.96 59.18,52.96 59.18,46.42 59.18,42.61 59.18,43.88 59.18,41.21 35.05,39.37 40,32.64 57.78,54.36 59.18,45.15 30.23,34.29 59.18,54.36 41.21,22.29 41.21,18.48 48.45,45.66 53.15,45.66 50.17,46.04 52.07,33.53 36.32,50.55 66.55,14.99 57.78,34.8 73.41,34.8 76.71,34.8 58.93,34.8 57.78,33.66 58.93,33.66 78.11,13.97 77.09,13.97 50.8,23.11 8.13,33.66 75.69,34.8 74.55,34.8 83.44,28.32 84.58,30.61 84.58,28.32 84.58,29.46 66.42,22.23 72.01,27.05 72.52,28.07 79.12,13.97 61.59,20.83 32.89,22.99 71.88,16 83.82,48.51 83.82,47.24 83.82,45.97 83.82,44.7 83.82,43.43 83.82,42.16 79.25,8.89
  pour Top: -1.65,55.31 60.07,55.31 60.07,32.13 -1.65,32.13
  pour Bottom: 0.25,35.88 0.25,1.52 85.22,1.52 85.22,35.88
  pour Top: -3.87,35.24 -3.87,1.52 83.19,1.52 83.19,35.24
  pour Bottom: 85.09,55.31 85.09,36.83 -1.65,36.83 -1.65,55.31
  pour Top: 81.98,56.2 81.98,3.94 116.33,3.94 116.33,56.2
CS  (via drill 0.61)
  Top 0.254: R12.1 35.24,42.23 v36.13,41.34 | R8.2 C11.1 39.12,36.13 v40.17,37.17 | IC6.3 v42.67,40.7
  Bottom 0.254: v40.17,37.17 40.26,37.27 40.26,39.94 | v36.13,41.34 37.53,39.94 40.26,39.94 | 40.26,39.94 41.91,39.94 v42.67,40.7
FB
  Top 0.254: R15.1 C6.2 14.22,33.08 14.22,32.13 14.54,31.81 18.35,31.81 19.62,33.09 R16.2 19.62,36.26 29.78,36.26 30.42,36.89 30.42,39.12 30.73,39.43 30.73,39.88 31.06,40.21 35.4,40.21 35.54,40.07 41.4,40.07 IC6.2 41.4,44.21 41.57,44.39 44.58,44.39 45.72,43.24 45.72,41.15 45.85,41.02 47.1,41.02 C5.2
HT
  Top 0.254: TUBES.5 13.27,19.43 13.57,19.73 15.79,19.73 15.81,19.75 16.13,19.43 T3.2
HT-ENABLE  (via drill 0.61)
  Top 0.254: IC4.12 59.94,22.94 59.94,28.07 59.88,28.13 v59.88,28.26 | v60.01,30.99 48.7,30.99 48.01,31.69 44.32,31.69 44.07,31.94 R1.2
  Bottom 0.254: v60.01,30.99 59.88,30.86 v59.88,28.26
IRQ  (via drill 0.61)
  Top 0.254: R25.2 23.56,15.24 v21.21,12.89 21.21,13.08 20.89,13.4 12.83,13.4 12.83,13.44 10.78,15.49 4.57,15.49 TUBES.7 | IC4.11 60.58,17.02 v60.96,16.64
  Bottom 0.254: v21.21,12.89 22.48,12.89 25.46,15.88 25.74,15.88 25.86,16 53.85,16 55.76,14.1 60.45,14.1 62.45,12.1 64.99,12.1 65.72,12.83 65.72,14.48 64.71,15.49 61.59,15.49 61.09,16 61.09,16.51 v60.96,16.64
LDR
  Top 0.254: IC4.23 54.53,16.93 53.98,16.38 53.98,15.75 54.42,15.31 54.42,15.24 55.88,13.78 55.88,10.92 56.39,10.41 65.79,10.41 67.01,9.2 67.01,8.9 67.01,7.13 67.29,6.84 70.34,6.84 70.36,6.86 | R3.2 70.36,6.86 | 70.36,6.86 70.36,8.32 R5.2
LED
  Top 0.254: IC4.25 56.57,11.51 57.1,10.97 66.09,10.97 66.6,11.48 68.53,11.48 68.83,11.18 71.63,11.18 73.15,12.7 80.26,12.7 82.16,10.8 82.16,9.4 84.33,9.4 85.34,8.38 R6.2
MISO  (via drill 0.61)
  Top 0.254: v31.56,19.24 PGM.9 | IC4.16 55.5,22.95 v55.5,24.89
  Bottom 0.254: v55.5,24.89 55.5,25.21 55.31,25.4 37.11,25.4 36.41,26.1 27.88,26.1 27.56,25.78 27.56,24.64 31.56,20.64 v31.56,19.24
MOSI  (via drill 0.61)
  Top 0.254: PGM.1 25.08,17.97 25.84,17.21 v27.24,17.21 | IC4.15 57.4,22.96 57.4,25.59 v57.3,25.7
  Bottom 0.254: v27.24,17.21 27.24,23.05 26.42,23.88 26.42,26.54 27.05,27.18 36.77,27.18 37.53,26.42 56.77,26.42 57.3,25.88 v57.3,25.7
N$1
  Top 0.254: LED1.2 87.76,4.13 R6.1
N$2
  Top 0.254: IC8.P$4 100.8,26.19 101.22,25.78 | IC8.P$5 102.35,27.19 102.36,27.18
  Top 0.813: FUS1.2 96.47,22.05 97.28,22.86 100.08,22.86 100.84,23.62 100.84,25.4 101.22,25.78 102.36,25.78 | 102.36,25.78 C4.1 | 102.36,25.78 102.36,27.18 102.36,32.68 106.51,36.83 L1.1
N$3
  Top 0.254: T4.3 64.45,28.38 64.77,28.7 69.47,28.7 69.72,28.45 69.72,26.03 70.23,25.53 75.82,25.53 76.33,25.02 76.33,18.16 76.52,17.97 SG3.-
N$5
  Top 0.254: IC4.7 64.77,20.93 64.77,23.05 EXOS.TP
N$6
  Top 0.254: C6.1 16.13,33.72 16.13,34.99 15.81,35.31 9.78,35.31 | R15.2 9.78,35.31 | 9.78,35.31 5.14,35.31 4.79,35.66 4.79,38.35 | 3.87,38.37 L5.1 4.78,38.37 4.79,38.35 | C2.1 7.35,41.27 5.21,41.27 4.79,40.86 4.79,38.35
  Top 0.813: D1.C C1.1 13.91,40.07 13.59,39.75 7.56,39.75 C2.1 C12.1
N$7
  Top 0.254: T2.3 19.45,21.02 17.72,21.02 17.4,20.7 17.4,17.84 17.08,17.53 15.35,17.53 T3.1 14.33,18.55 R21.1
N$8
  Top 0.254: T1.1 46.91,36.13 R4.1 R1.1
N$9  (via drill 0.61)
  Top 0.254: D2.C 53.01,40.98 R7.1 54.99,40.96 R9.2 57.47,40.96 57.53,40.89 v57.59,40.96 | T1.3 51.65,36.41 52.07,36.83 C14.1 v57.53,36.83
  Bottom 0.254: v57.59,40.96 57.59,36.89 v57.53,36.83
N$10
  Top 0.254: IC6.1 40.13,44.96 40.32,45.15 46.67,45.15 47.12,44.7 47.12,43.16 47.24,43.04 | D2.A 49.72,43.04 47.24,43.04 | 47.24,43.04 C5.1
N$11  (via drill 0.61)
  Top 0.254: R11.1 87.88,30.29 v87.88,29.72 86.87,28.7 R13.2 | v96.52,25.91 96.81,26.19 IC8.P$3
  Bottom 0.254: v96.52,25.91 90.17,25.91 89.41,26.67 89.41,29.46 89.15,29.72 v87.88,29.72
N$12
  Top 0.254: R8.1 34.08,34.23 R10.1
  Top 1.016: 26.61,30.99 32.45,30.99 32.96,31.5 R10.1
  Top 1.27: IC7.1 IC7.2 | IC7.2 IC7.3 | 26.61,30.99 25.97,31.62 IC7.2
N$13
  Top 0.61: IC8.P$1 98.04,28.96
  Top 0.813: 98.04,35.96 97.3,35.22 D3.A | 98.04,28.96 98.04,35.96 | 98.04,35.96 L1.2
N$14
  Top 0.254: C8.2 46.99,50.8 46.61,51.18 42.17,51.18 41.4,50.42 IC6.7 41.4,50.4 40.15,50.4 37.72,52.83 L2.2 25.91,52.83 25.91,52.25 L3.1
N$18
  Top 0.254: C15.1 21.28,38.02 IC7.8 | L3.2 25.7,40.39 25.34,40.39 25.97,39.75 | 24.7,39.75 25.07,39.75 L3.2 | L3.2 26.87,40.65 27.24,41.02 28.51,39.75
  Top 0.508: IC7.5 28.51,39.75
  Top 0.813: 25.97,39.75 IC7.7 | L3.2 27.24,39.38 IC7.6 | 24.7,39.75 IC7.8
  Top 2.54: D1.A 18.06,50.21 19.62,48.64 19.62,41.34 20.57,40.39 25.34,40.39
N$19
  Top 0.254: R20.1 18.67,15.4 T2.1
N$23
  Top 0.254: D40.A 81.47,35.12 79.06,32.7 R22.2
OUT  (via drill 0.61)
  Top 0.254: 28.51,34.35 v28.51,34.67
  Top 0.305: IC7.4 28.51,34.35 | IC6.6 42.67,46.42 v42.55,46.29
  Bottom 0.254: v28.51,34.67 29.15,35.31 45.08,35.31 45.59,35.81 45.59,45.97 45.28,46.29 v42.55,46.29
POSTFUSE  (via drill 0.61)
  Top 0.254: R4.2 46.86,32.78 47.24,32.4 60.33,32.4 60.71,32.78 60.71,51.56 | R7.2 53.02,44.01 53.85,44.83 55.37,44.83 56.26,45.72 56.26,51.56
  Top 0.813: 53.47,53.09 50.48,53.09 | 50.48,53.09 39.86,53.09 L2.1 | 50.48,53.09 50.23,52.83 C18.1 | C16.2 53.15,52.77 53.47,53.09 | 53.47,53.09 54.1,53.72 56.39,53.72 56.39,51.56 | 56.26,51.56 56.39,51.56 | 56.39,51.56 60.71,51.56 74.55,51.56 75.44,50.67 83.44,50.67 v83.57,50.8 | C9.1 D3.C 92.2,32.26 91.69,32.77 87.31,32.77 R11.2 86.87,34.54 93.73,41.4 104.14,41.4 105.41,42.67 v105.41,47.5 104.55,46.63 IC3.3
  Bottom 0.813: v83.57,50.8 83.82,50.8 86.61,48.01 104.9,48.01 v105.41,47.5
PWM  (via drill 0.61)
  Top 0.254: IC4.14 58.36,23.1 58.36,26.23 v58.61,26.48 | R20.2 19.94,15.84 v19.94,16.89
  Bottom 0.254: v58.61,26.48 57.98,26.48 57.34,27.12 37.66,27.12 37.08,27.69 26.8,27.69 25.91,26.8 25.91,16.76 25.53,16.38 22.73,16.38 PWM.TP 22.23,16.89 v19.94,16.89
RAW_HT  (via drill 0.61)
  Top 0.254: T3.3 15.03,20.7 12.32,20.7 | 3.56,41.91 v3.68,42.04 | R21.2 16.03,14.57 15.49,14.03 12.95,14.03 12.32,14.67 v12.32,17.84 | v12.32,21.65 12.32,20.7 | L5.2 3.53,40.28 2.92,40.28 | 12.32,20.7 1.65,20.7 1.14,21.21 1.14,32.43 C3.1
  Top 0.508: 2.92,40.28 2.43,39.79 C3.1 | L5.2 3.62,41.85 3.56,41.91
  Bottom 0.254: v12.32,17.84 v12.32,21.65 | HT.TP 3.68,43.43 v3.68,42.04
RC  (via drill 0.61)
  Top 0.254: R2.1 38.8,41.02 v39.37,41.02 | v44.58,41.27 43.94,41.91 IC6.4 | C7.1 42.8,37.4 v42.8,37.46
  Bottom 0.254: v39.37,41.02 41.78,41.02 42.3,41.54 44.31,41.54 v44.58,41.27 44.43,41.27 42.8,39.64 v42.8,37.46
REF
  Top 0.254: C10.1 34.42,48.58 R12.2 R2.2 37.59,48.13 37.91,48.45 40.13,48.45 IC6.8
RESET  (via drill 0.61)
  Top 0.254: v57.53,12.19 59.31,12.19 59.77,12.65 IC4.29 | PGM.5 27.62,20.23 28.07,20.68 32.51,20.68 32.77,20.42 32.77,15.31 R14.2 32.77,15.17 32.67,15.08 32.67,14.32 33.15,13.84 44.83,13.84 46.23,15.24 52.45,15.24 53.34,14.35 v53.34,13.72 53.34,10.41 53.85,9.91 65.28,9.91 65.79,9.4 65.79,4.06 66.04,3.81 76.2,3.81 76.74,4.35 S1.1
  Bottom 0.254: v57.53,12.19 54.86,12.19 v53.34,13.72
RX  (via drill 0.61)
  Top 0.254: v28.51,25.21 26.86,25.21 26.35,24.7 PGM.4 | IC4.30 60.58,13.54 61.47,12.65 63.7,12.65 64.64,13.59 v64.64,13.97
  Bottom 0.254: v28.51,25.21 28.51,24.51 28.83,24.19 33.91,24.19 34.42,23.69 34.42,18.8 36.08,17.13 54.1,17.13 54.61,16.62 54.61,15.96 55.97,14.61 60.83,14.61 62.74,12.7 64.26,12.7 64.64,13.08 v64.64,13.97
SCK  (via drill 0.61)
  Top 0.254: v29.27,16.95 28.89,17.34 PGM.7 | IC4.17 54.42,22.67 v54.42,23.81
  Bottom 0.254: v29.27,16.95 29.27,21.91 26.92,24.26 26.92,26.1 27.5,26.67 36.56,26.67 37.32,25.91 56.01,25.91 56.45,25.46 56.45,24.07 56.19,23.81 v54.42,23.81
SCL  (via drill 0.61)
  Top 0.254: TUBES.3 3.43,24.26 4.19,23.49 17.65,23.49 17.66,23.5 18.67,23.5 | 18.67,23.5 R26.2 | IC4.28 58.98,16.46 59.69,16.46 v59.69,16.64 | v35.81,21.02 IC2.16 35.81,27.37 35.24,27.94 22.67,27.94 22.23,27.49 22.23,24.32 21.4,23.5 18.67,23.5
  Bottom 0.254: v59.69,16.64 59.69,15.94 59.5,15.75 56.26,15.75 55.63,16.38 55.63,18.67 54.61,19.69 37.15,19.69 v35.81,21.02
SDA  (via drill 0.61)
  Top 0.254: R27.2 16.13,24.83 16.06,24.77 10.79,24.77 10.73,24.83 10.73,26.73 10.41,27.05 | IC4.27 58.19,16.67 v58.17,16.7 | v37.08,21.02 IC2.15 37.08,28.07 36.58,28.58 16.7,28.58 16.13,28
  Top 0.305: R27.2 16.13,28 | 10.41,27.05 TUBES.2
  Bottom 0.254: v37.08,21.02 37.78,20.32 54.74,20.32 56.26,18.8 56.26,17.78 56.64,17.4 58.17,17.4 v58.17,16.7
TX  (via drill 0.61)
  Top 0.254: PGM.6 27.62,24.26 28.89,24.26 v29.78,25.15 | IC4.31 61.37,13.59 v63.37,13.59
  Bottom 0.254: v29.78,25.15 34.54,25.15 34.92,24.77 34.92,19.43 35.31,19.05 39.45,19.05 40.86,17.64 54.37,17.64 55.12,16.89 55.12,16.17 56.18,15.11 61.21,15.11 62.74,13.59 v63.37,13.59
VCC/2
  Top 0.406: J2.1 98.27,7.84 98.3,7.87
  Top 0.813: 98.3,7.87 99.57,9.14 100.58,9.14 102.11,10.67 SV4.3 102.11,15.75 102.67,16.31 FUS1.1

### Text on the board
tNames: www.steamclock.ch | Mark 1.7.0 | +BATT+